# Altium project MCU023_MSP432E401Y.PrjPcb (part 3 of 3)

## Sheet MCU023_XDS110_Target_Interface.SchDoc
size 431 x 279 mm; Date: Not shown in title block; ApprovedBy: Not shown in title block; CheckedBy: Not shown in title block; Author: Not shown in title block; CompanyName: Not shown in title block; Engineer: Not shown in title block; Organization: Not shown in title block; Address1: Not shown in title block; Address2: Not shown in title block; Address3: Not shown in title block; Address4: Not shown in title block; DocumentNumber: 1; Revision: Use project parameter SCH_Rev; SheetNumber: 4; SheetTotal: 6; PageSetup: Record=PageOptions|CenterHorizontal=True|CenterVertical=True|PrintScale=1.00|XCorrection=1.00|YCorrection=1.00|PrintKind=0|BorderSize=5000000|LeftOffset=0|BottomOffset=0|Orientation=2|PaperLength=1000|PaperWidth=1000|Scale=100|PaperSource=15|PrintQuality=600|MediaType=1|DitherType=10|PaperKind=Letter|PrintScaleMode=1; CurrentTime: Not shown in title block; CurrentDate: Not shown in title block; Time: Not shown in title block; DocumentFullPathAndName: Not shown in title block; DocumentName: Not shown in title block; ModifiedDate: Not shown in title block; ImagePath: Not shown in title block
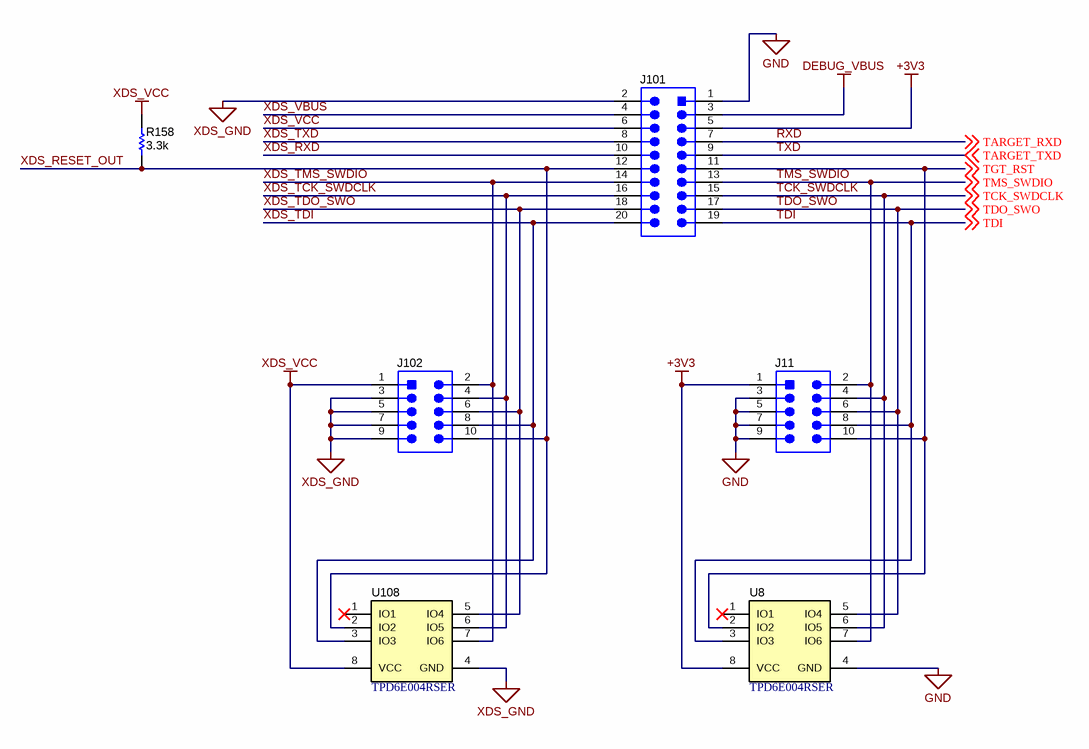
[diagram p3: MCU023_XDS110_Target_Interface.SchDoc]

### Parts
J11  FTSH-105-01-F-DV-K  [Samtec_FTSH-105-01-x-DV-K]  (value not drawn)
J101  PEC10DAAN  [SULLINS_PEC10DAAN]  (value not drawn)
J102  FTSH-105-01-F-DV-K  [Samtec_FTSH-105-01-x-DV-K]  (value not drawn)
R158  ValueDisplayed: 3.3k  [0402]  (hidden comment: CRCW04023K30JNED)
U8  TPD6E004RSER  [RSE0008A]
U108  TPD6E004RSER  [RSE0008A]

### Nets
+3V3: J11.1 J101.5 U8.8(VCC)
DEBUG_VBUS: J101.3
GND: J11.3 J11.5 J11.7 J11.9 J101.1 U8.4(GND)
XDS_GND: J101.2 J102.3 J102.5 J102.7 J102.9 U108.4(GND)
XDS_VCC: J101.6 J102.1 R158.2 U108.8(VCC)
RXD: J101.7 ; off-sheet TARGET_RXD  [also labelled TARGET_RXD]
TARGET_TXD: J101.9 ; off-sheet TARGET_TXD  [also labelled TXD]
TCK_SWDCLK: J11.4 J101.15 U8.6(IO5) ; off-sheet TCK_SWDCLK
TDI: J11.8 J101.19 U8.3(IO3) ; off-sheet TDI
TDO_SWO: J11.6 J101.17 U8.5(IO4) ; off-sheet TDO_SWO
TGT_RST: J11.10 J101.11 U8.2(IO2) ; off-sheet TGT_RST  [project net TARGET_RESET]
TMS_SWDIO: J11.2 J101.13 U8.7(IO6) ; off-sheet TMS_SWDIO
XDS_RESET_OUT: J101.12 J102.10 R158.1 U108.2(IO2)
XDS_RXD: J101.10
XDS_TCK_SWDCLK: J101.16 J102.4 U108.6(IO5)
XDS_TDI: J101.20 J102.8 U108.3(IO3)
XDS_TDO_SWO: J101.18 J102.6 U108.5(IO4)
XDS_TMS_SWDIO: J101.14 J102.2 U108.7(IO6)
XDS_TXD: J101.8
XDS_VBUS: J101.4

Not connected (* = marked no-connect by the designer): U8 1(IO1)*; U108 1(IO1)*

### Notes on the sheet
- Drawn By:
- SVN Rev:
- Number:
- TID #:
- Orderable:
- Rev:
- Sheet Title:
- File:
- Project Title:
- Designed for:
- Assembly Variant:
- Mod. Date:
- Sheet:
- Size:
- of
- B
- http://www.ti.com
- Texas Instruments and/or its licensors do not warrant the accuracy or completeness of this specification or any information contained therein. Texas Instruments and/or its licensors do not warrant that this design will meet the specifications, will be suitable for your application or fit for any particular purpose, or will operate in an implementation. Texas Instruments and/or its licensors do not warrant that the design is production worthy. You should completely validate and test your design implementation to confirm the system functionality for your application.
- Engineer:
- Contact:
- © Texas Instruments

### Library data of the parts
J11 J102 = FTSH-105-01-F-DV-K: Header (Shrouded), 1.27mm, 5x2, Gold, SMT; Manufacturer: Samtec; SymbolCreator: a0412235; Pitch_mm: 1.27; Gender: Male; Shrouded: Y; Row_Count: 2; Current_A: 3.3; SymbolVersion: 2013-12-22; PartNumber: FTSH-105-01-F-DV-K; PackageReference: Header(Shrouded), 1.27mm, 5x2, SMT; CompType: Header; RoHS: Y; MountType: SMT; ComponentLink1Description: Datasheet URL; ComponentLink1URL: http://suddendocs.samtec.com/prints/ftsh-1xx-xx-xxx-dv-xxx-mkt.pdf; Orientation: Vertical; PinCount: 10; RowSpacing_mm: 1.27; ContactFinish: Gold; Color: Black; Cert_CSA: Y; Cert_UL: Y; Publisher: Texas Instruments; LatestRevisionDate: 2016-12-09; Supplier 1: Digi-Key; Supplier Part Number 1: SAM8796-ND
J101 = PEC10DAAN: Header, 2.54mm, 10x2, Tin, TH; Manufacturer: Sullins Connector Solutions; SymbolCreator: a0412235; Pitch_mm: 2.54; Gender: Male; Shrouded: N; Row_Count: 2; Current_A: 3; Cert_UL: Y; Green_Lifecycle: Not Set; Green_REACh: Incomplete; SymbolVersion: 2013-09-12; PartNumber: PEC10DAAN; PackageReference: Header, 10x2, 2.54mm, TH; ClassName: Header; CompType: Header; RoHS: Y; MountType: TH; ComponentLink1Description: Datasheet URL; ComponentLink1URL: https://drawings-pdf.s3.amazonaws.com/C10419.pdf; Orientation: Vertical; PinCount: 20; RowSpacing_mm: 2.54; ContactFinish: Tin; Color: Black; Publisher: Texas Instruments; LatestRevisionDate: 2017-05-05; Supplier 1: Digi-Key; Supplier Part Number 1: S2012E-10-ND; Green_EU RoHS: Incomplete; Green_EU RoHS-2: Incomplete
R158 = CRCW04023K30JNED: RES, 3.3 k, 5%, 0.063 W, 0402; Manufacturer: Vishay-Dale; CompType: Resistor; Value: 3.3k; Res_ohm: 3300; Value_Code: 3k30; Tolerance_%: 5; Power_W: 0.063; Value2: 0.063W; VDC_V: 50; TempCo: 200 ppm/C; SizeArea_mm2: 0.5; SizeX_mm: 1; SizeZ_mm: 0.6; EIA_Code: E24; U/M: EA; AEC Category: Q200; SymbolVersion: 2009-05-29; PartNumber: CRCW04023K30JNED; PackageReference: 0402; RoHS: Y; Value1: 5%; MountType: SMT; Technology: Thick Film; SizeY_mm: 0.5; Published: 2008-06-26; Publisher: Texas Instruments; LatestRevisionDate: 2017-04-13; ComponentLink1Description: Datasheet link; ComponentLink1URL: http://www.vishay.com/docs/20035/dcrcwe3.pdf; Supplier 1: Digi-Key; Supplier Part Number 1: 541-3.3KJCT-ND; Supplier 2: Newark; Supplier Part Number 2: 59M6723; Supplier 3: Mouser; Supplier Part Number 3: 71-CRCW0402J-3.3K-E3; AEC Qualified: ?
U8 U108 = TPD6E004RSER: Low-Capacitance + / - 15 kV ESD Protection Array for High-Speed Data Interfaces, 6 Channels, -40 to +85 degC, 8-pin UQFN (RSE), Green (RoHS & no Sb/Br); Manufacturer: Texas Instruments; Alternate PartNumber: Equivalent; 1394 / Firewire: TRUE; Breakdown Voltage(Min)(V): 6; IEC 61000-4-2 Air-Gap(+/- kV): 12; IEC 61000-4-2 Contact(+/- kV): 8; IO Capacitance(Typ)(pF): 1.6; IO Leakage Current(nA): 1; SubFamily: ESD Solution; Note: TI Supplied; DatasheetVersion: SLLS799A; PackageVersion: revD, Jan-2011; PackageReference: RSE0008A; PackageDescription: 8-Pin Plastic Quad Flatpack No-Lead, 1.5 x 1.5 mm Body, 0.5 mm Pitch; Supplier 1: Digi-Key; Supplier Part Number 1: 296-23619-2-ND; Supplier 2: Digi-Key; Supplier Part Number 2: 296-23619-1-ND; Supplier 3: Digi-Key; Supplier Part Number 3: 296-23619-6-ND; Supplier 4: Farnell; Supplier Part Number 4: 1755333; Supplier 5: Newark; Supplier Part Number 5: 85M0178; Supplier 6: Mouser; Supplier Part Number 6: 595-TPD6E004RSER; Eco-Plan: Green (RoHS & no Sb/Br); Serial ATA / eSATA: TRUE; USB High Speed: TRUE; MountType: SMT; Code_JEDEC: MO-288; PartNumber: TPD6E004RSER; ComponentLink1Description: Datasheet; ComponentLink1URL: http://www.ti.com/general/docs/lit/getliterature.tsp?genericPartNumber=TPD6E004&fileType=pdf; ComponentLink2Description: URL Link1; ComponentLink2URL: SamplesURL:http://www.ti.com/product/tpd6e004#samples; Alternate Manufacturer: Texas Instruments

## Sheet MCU023_XDS110_Debug_Probe.SchDoc
size 431 x 279 mm; Date: Not shown in title block; ApprovedBy: Not shown in title block; CheckedBy: Not shown in title block; Author: Not shown in title block; CompanyName: Not shown in title block; Engineer: Not shown in title block; Organization: Not shown in title block; Address1: Not shown in title block; Address2: Not shown in title block; Address3: Not shown in title block; Address4: Not shown in title block; DocumentNumber: 1; Revision: Use project parameter SCH_Rev; SheetNumber: 5; SheetTotal: 6; PageSetup: Record=PageOptions|CenterHorizontal=True|CenterVertical=True|PrintScale=1.00|XCorrection=1.00|YCorrection=1.00|PrintKind=0|BorderSize=5000000|LeftOffset=0|BottomOffset=0|Orientation=2|PaperLength=1000|PaperWidth=1000|Scale=100|PaperSource=15|PrintQuality=600|MediaType=1|DitherType=10|PaperKind=Letter|PrintScaleMode=1; CurrentTime: Not shown in title block; CurrentDate: Not shown in title block; Time: Not shown in title block; DocumentFullPathAndName: Not shown in title block; DocumentName: Not shown in title block; ModifiedDate: Not shown in title block; ImagePath: Not shown in title block
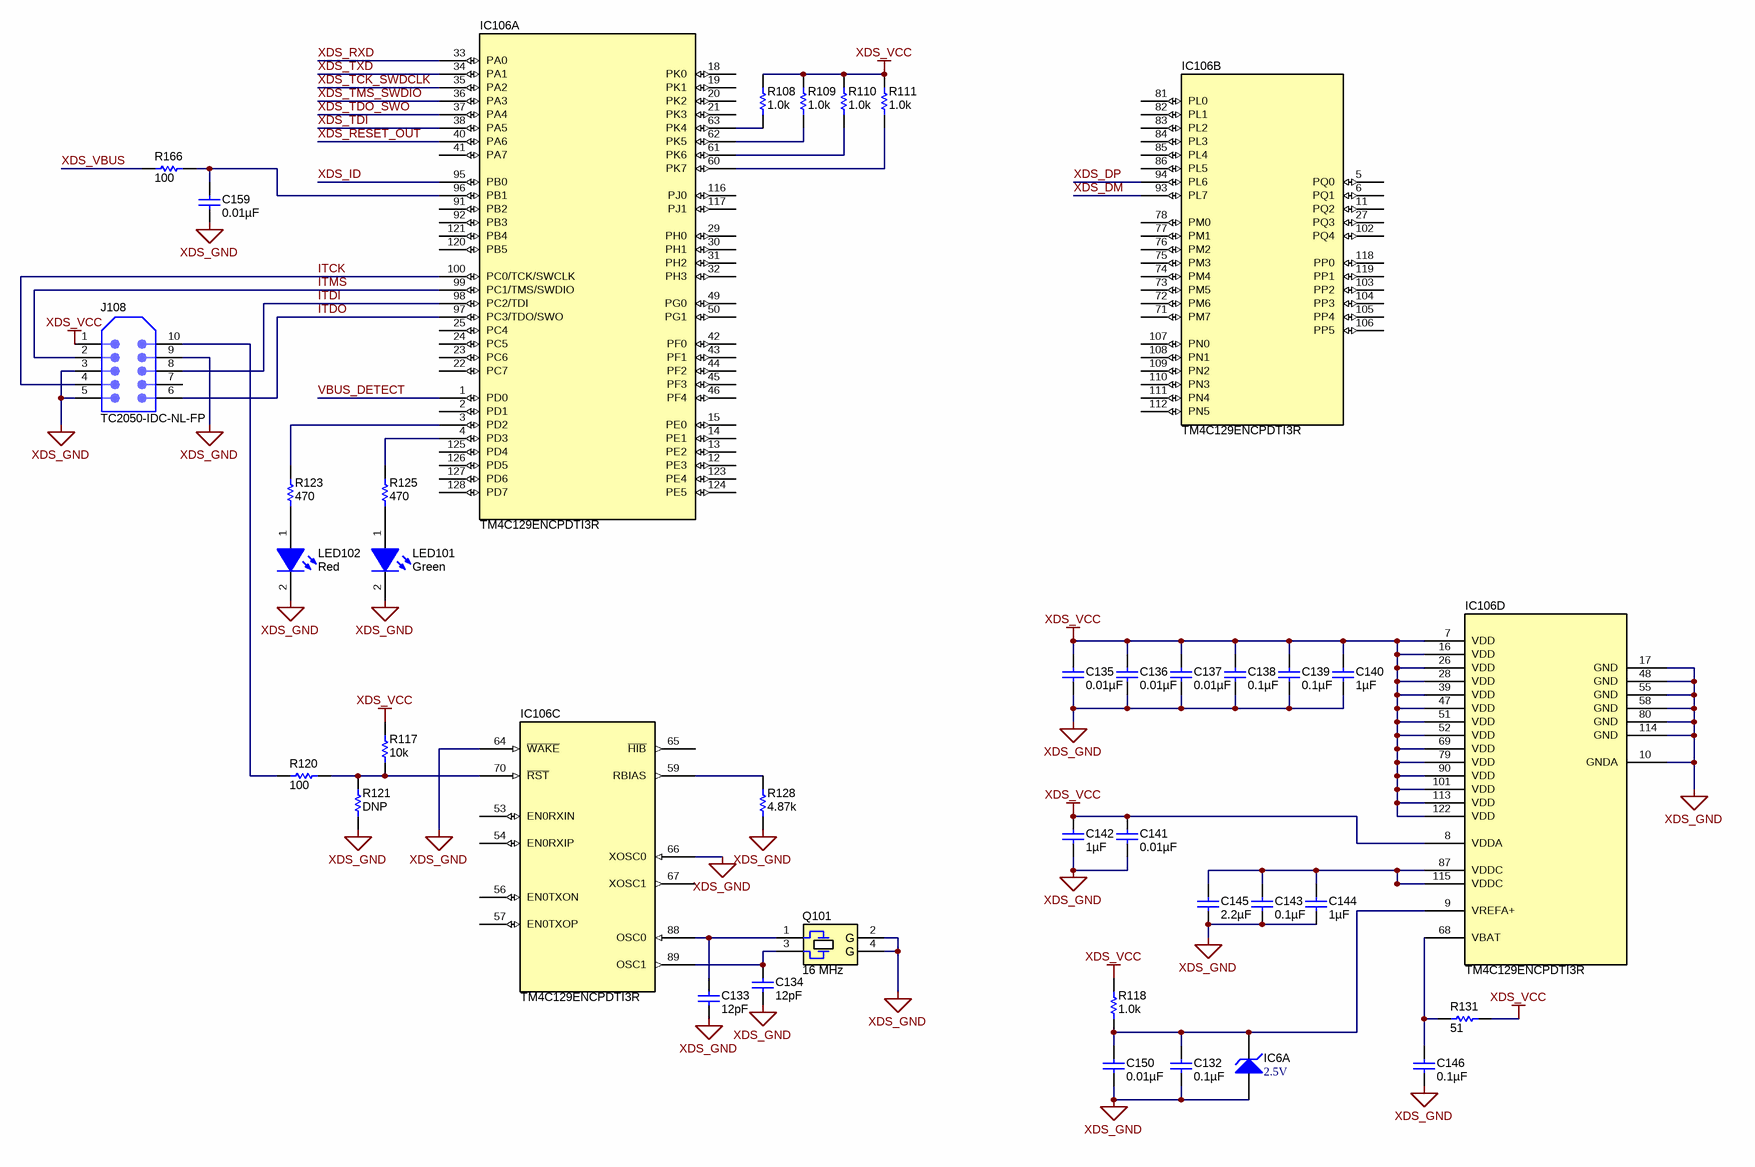
[diagram p4: MCU023_XDS110_Debug_Probe.SchDoc]

### Parts
C132  ValueDisplayed: 0.1µF  [0402]  (hidden comment: GRM155R70J104KA01D)
C133  ValueDisplayed: 12pF  [0402]  (hidden comment: GRM1555C1H120JA01D)
C134  ValueDisplayed: 12pF  [0402]  (hidden comment: GRM1555C1H120JA01D)
C135  ValueDisplayed: 0.01µF  [0402]  (hidden comment: GRM155R71E103KA01D)
C136  ValueDisplayed: 0.01µF  [0402]  (hidden comment: GRM155R71E103KA01D)
C137  ValueDisplayed: 0.01µF  [0402]  (hidden comment: GRM155R71E103KA01D)
C138  ValueDisplayed: 0.1µF  [0402]  (hidden comment: GRM155R70J104KA01D)
C139  ValueDisplayed: 0.1µF  [0402]  (hidden comment: GRM155R70J104KA01D)
C140  ValueDisplayed: 1µF  [0402]  (hidden comment: GRM155R61A105KE15D)
C141  ValueDisplayed: 0.01µF  [0402]  (hidden comment: GRM155R71E103KA01D)
C142  ValueDisplayed: 1µF  [0402]  (hidden comment: GRM155R61A105KE15D)
C143  ValueDisplayed: 0.1µF  [0402]  (hidden comment: GRM155R70J104KA01D)
C144  ValueDisplayed: 1µF  [0402]  (hidden comment: GRM155R61A105KE15D)
C145  ValueDisplayed: 2.2µF  [0402]  (hidden comment: GRM155R60J225KE95D)
C146  ValueDisplayed: 0.1µF  [0402]  (hidden comment: GRM155R70J104KA01D)
C150  ValueDisplayed: 0.01µF  [0402]  (hidden comment: GRM155R71E103KA01D)
C159  ValueDisplayed: 0.01µF  [0402]  (hidden comment: GRM155R71E103KA01D)
IC6  2.5V  [DCK0005A_N]  (part A of 2)
IC106  TM4C129ENCPDTI3R  [PDT0128A]  (parts A,B,C,D of 4)
J108  TC2050-IDC-NL-FP  [Tag_TC2050-NL]  (no BOM)
LED101  value Green  [LED_LTST-C190]  (hidden comment: LTST-C190GKT)
LED102  value Red  [LED_LTST-C190_Red]  (hidden comment: LTST-C190CKT)
Q101  Frequency: 16 MHz  [NDK_NX3225GA]  (hidden comment: NX3225GA-16.000M-STD-CRG-1)
R108  ValueDisplayed: 1.0k  [0402]  (hidden comment: CRCW04021K00JNED)
R109  ValueDisplayed: 1.0k  [0402]  (hidden comment: CRCW04021K00JNED)
R110  ValueDisplayed: 1.0k  [0402]  (hidden comment: CRCW04021K00JNED)
R111  ValueDisplayed: 1.0k  [0402]  (hidden comment: CRCW04021K00JNED)
R117  ValueDisplayed: 10k  [0402]  (hidden comment: CRCW040210K0JNED)
R118  ValueDisplayed: 1.0k  [0402]  (hidden comment: CRCW04021K00JNED)
R120  ValueDisplayed: 100  [0402]  (hidden comment: CRCW0402100RJNED)
R121  ValueDisplayed: DNP  [0402]  (hidden comment: CRCW040210K0JNED)
R123  ValueDisplayed: 470  [0402]  (hidden comment: ERJ-2RKF4700X)
R125  ValueDisplayed: 470  [0402]  (hidden comment: ERJ-2RKF4700X)
R128  ValueDisplayed: 4.87k  [0402]  (hidden comment: CRCW04024K87FKED)
R131  ValueDisplayed: 51  [0402]  (hidden comment: CRCW040251R0JNED)
R166  ValueDisplayed: 100  [0402]  (hidden comment: CRCW0402100RJNED)

### Nets
XDS_GND: C132.2 C133.2 C134.2 C135.2 C136.2 C137.2 C138.2 C139.2 C140.2 C141.2 C142.2 C143.2 C144.2 C145.2 C146.2 C150.2 C159.2 IC6.1(ANODE) IC106.10(GNDA) IC106.17(GND) IC106.48(GND) IC106.55(GND) IC106.58(GND) IC106.64(~{WAKE}) IC106.66(XOSC0) IC106.80(GND) IC106.114(GND) J108.3 J108.5 J108.9 LED101.2(K) LED102.2(K) Q101.2(GND) Q101.4(GND) R121.1 R128.1
XDS_VCC: C135.1 C136.1 C137.1 C138.1 C139.1 C140.1 C141.1 C142.1 IC106.7(VDD) IC106.8(VDDA) IC106.16(VDD) IC106.26(VDD) IC106.28(VDD) IC106.39(VDD) IC106.47(VDD) IC106.51(VDD) IC106.52(VDD) IC106.69(VDD) IC106.79(VDD) IC106.90(VDD) IC106.101(VDD) IC106.113(VDD) IC106.122(VDD) J108.1 R108.2 R109.2 R110.2 R111.2 R117.2 R118.2 R131.2
ITCK: IC106.100(PC0/TCK/SWCLK) J108.4
ITDI: IC106.98(PC2/TDI) J108.8
ITDO: IC106.97(PC3/TDO/SWO) J108.6
ITMS: IC106.99(PC1/TMS/SWDIO) J108.2
VBUS_DETECT: IC106.1(PD0)
XDS_DM: IC106.93(PL7)
XDS_DP: IC106.94(PL6)
XDS_ID: IC106.95(PB0)
XDS_RESET_OUT: IC106.40(PA6)
XDS_RXD: IC106.33(PA0)
XDS_TCK_SWDCLK: IC106.35(PA2)
XDS_TDI: IC106.38(PA5)
XDS_TDO_SWO: IC106.37(PA4)
XDS_TMS_SWDIO: IC106.36(PA3)
XDS_TXD: IC106.34(PA1)
XDS_VBUS: R166.1
NetC132_1: C132.1 C150.1 IC6.3(CATHODE) IC106.9(VREFA+) R118.1
NetC133_1: C133.1 IC106.88(OSC0) Q101.1
NetC134_1: C134.1 IC106.89(OSC1) Q101.3
NetC143_1: C143.1 C144.1 C145.1 IC106.87(VDDC) IC106.115(VDDC)
NetC146_1: C146.1 IC106.68(VBAT) R131.1
NetC159_1: C159.1 IC106.96(PB1) R166.2
NetIC106_3: IC106.3(PD2) R123.2
NetIC106_4: IC106.4(PD3) R125.2
NetIC106_59: IC106.59(RBIAS) R128.2
NetIC106_60: IC106.60(PK7) R111.1
NetIC106_61: IC106.61(PK6) R110.1
NetIC106_62: IC106.62(PK5) R109.1
NetIC106_63: IC106.63(PK4) R108.1
NetIC106_70: IC106.70(~{RST}) R117.1 R120.2 R121.2
NetJ108_10: J108.10 R120.1
NetLED101_1: LED101.1(A) R125.1
NetLED102_1: LED102.1(A) R123.1

Not connected (* = marked no-connect by the designer): IC106 2(PD1) 5(PQ0) 6(PQ1) 11(PQ2) 12(PE3) 13(PE2) 14(PE1) 15(PE0) 18(PK0) 19(PK1) 20(PK2) 21(PK3) 22(PC7) 23(PC6) 24(PC5) 25(PC4) 27(PQ3) 29(PH0) 30(PH1) 31(PH2) 32(PH3) 41(PA7) 42(PF0) 43(PF1) 44(PF2) 45(PF3) 46(PF4) 49(PG0) 50(PG1) 53(EN0RXIN) 54(EN0RXIP) 56(EN0TXON) 57(EN0TXOP) 65(~{HIB}) 67(XOSC1) 71(PM7) 72(PM6) 73(PM5) 74(PM4) 75(PM3) 76(PM2) 77(PM1) 78(PM0) 81(PL0) 82(PL1) 83(PL2) 84(PL3) 85(PL4) 86(PL5) 91(PB2) 92(PB3) 102(PQ4) 103(PP2) 104(PP3) 105(PP4) 106(PP5) 107(PN0) 108(PN1) 109(PN2) 110(PN3) 111(PN4) 112(PN5) 116(PJ0) 117(PJ1) 118(PP0) 119(PP1) 120(PB5) 121(PB4) 123(PE4) 124(PE5) 125(PD4) 126(PD5) 127(PD6) 128(PD7); J108 7

### Notes on the sheet
- Drawn By:
- SVN Rev:
- Number:
- TID #:
- Orderable:
- Rev:
- Sheet Title:
- File:
- Project Title:
- Designed for:
- Assembly Variant:
- Mod. Date:
- Sheet:
- Size:
- of
- B
- http://www.ti.com
- Texas Instruments and/or its licensors do not warrant the accuracy or completeness of this specification or any information contained therein. Texas Instruments and/or its licensors do not warrant that this design will meet the specifications, will be suitable for your application or fit for any particular purpose, or will operate in an implementation. Texas Instruments and/or its licensors do not warrant that the design is production worthy. You should completely validate and test your design implementation to confirm the system functionality for your application.
- Engineer:
- Contact:
- © Texas Instruments
- (in symbol NX3225GA-16.000M-STD-CRG-1) G

### Library data of the parts
C132 C138 C139 C143 C146 = GRM155R70J104KA01D: CAP, CERM, 0.1 µF, 6.3 V, +/- 10%, X7R, 0402; Manufacturer: MuRata; Polarized: N; CompType: Capacitor; Value: 0.1uF; U/M: EA; Cap_F: 0.0000001; Tolerance_%: 10; Value1: Unknown; VDC_V: 6.3; Value2: 6.3V; TaMin_C: -55; TaMax_C: 125; SizeArea_mm2: 0.5; SizeAreaWB_mm2: 3; SizeX_mm: 1; SizeZ_mm: 0.6; AEC Category: Q200; SymbolVersion: 2008-07-09; PartNumber: GRM155R70J104KA01D; PackageReference: 0402; RoHS: Y; MountType: SMT; Technology: Ceramic; TempCo: X7R; Cap_Case: 0402; SizeY_mm: 0.5; Published: 2008-06-19; Publisher: Texas Instruments; LatestRevisionDate: 2017-04-21; ComponentLink1Description: Datasheet link; ComponentLink1URL: http://search.murata.co.jp/Ceramy/PnsearchViewAction.do?HnOFG=ON&HnNFG=ON&SEL_CNT=50&sLang=en&sKey=GRM155R70J104KA01D&x=9&y=9&search=startwith; Supplier 1: Digi-Key; Supplier Part Number 1: GRM155R70J104KA01D-ND; Supplier 2: Mouser; Supplier Part Number 2: 81-GRM155R70J104KA1D; AEC Qualified: ?
C133 C134 = GRM1555C1H120JA01D: CAP, CERM, 12 pF, 50 V, +/- 5%, C0G/NP0, 0402; Manufacturer: MuRata; Polarized: N; CompType: Capacitor; Value: 12pF; U/M: EA; Cap_F: 0.000000000012; Tolerance_%: 5; Value1: Unknown; VDC_V: 50; Value2: 50V; TaMin_C: -55; TaMax_C: 125; SizeArea_mm2: 0.5; SizeAreaWB_mm2: 3; SizeX_mm: 1; SizeZ_mm: 0.6; AEC Category: Q200; SymbolVersion: 2008-07-09; PartNumber: GRM1555C1H120JA01D; PackageReference: 0402; RoHS: Y; MountType: SMT; Technology: Ceramic; TempCo: C0G/NP0; Cap_Case: 0402; SizeY_mm: 0.5; Published: 2008-06-19; Publisher: Texas Instruments; LatestRevisionDate: 2017-04-21; ComponentLink1Description: Datasheet link; ComponentLink1URL: http://search.murata.co.jp/Ceramy/PnsearchViewAction.do?HnOFG=ON&HnNFG=ON&SEL_CNT=50&sLang=en&sKey=GRM1555C1H120JA01D&x=9&y=9&search=startwith; Supplier 1: Newark; Supplier Part Number 1: 14T3292; Supplier 2: Mouser; Supplier Part Number 2: 81-GRM1555C1H120JA1D; Supplier 3: Farnell; Supplier Part Number 3: 1828875; AEC Qualified: ?
C135-C137 C141 C150 C159 = GRM155R71E103KA01D: CAP, CERM, 0.01 µF, 25 V, +/- 10%, X7R, 0402; Manufacturer: MuRata; Polarized: N; CompType: Capacitor; Value: 0.01uF; U/M: EA; Cap_F: 0.00000001; Tolerance_%: 10; Value1: Unknown; VDC_V: 25; Value2: 25V; TaMin_C: -55; TaMax_C: 125; SizeArea_mm2: 0.5; SizeAreaWB_mm2: 3; SizeX_mm: 1; SizeZ_mm: 0.6; AEC Category: Q200; SymbolVersion: 2008-07-09; PartNumber: GRM155R71E103KA01D; PackageReference: 0402; RoHS: Y; MountType: SMT; Technology: Ceramic; TempCo: X7R; Cap_Case: 0402; SizeY_mm: 0.5; Published: 2008-06-19; Publisher: Texas Instruments; LatestRevisionDate: 2017-04-21; ComponentLink1Description: Datasheet link; ComponentLink1URL: http://search.murata.co.jp/Ceramy/PnsearchViewAction.do?HnOFG=ON&HnNFG=ON&SEL_CNT=50&sLang=en&sKey=GRM155R71E103KA01D&x=9&y=9&search=startwith; Supplier 1: Digi-Key; Supplier Part Number 1: 490-1312-1-ND; Supplier 2: Mouser; Supplier Part Number 2: 81-GRM36X103K25; Supplier 3: Farnell; Supplier Part Number 3: 8819734; AEC Qualified: ?
C140 C142 C144 = GRM155R61A105KE15D: CAP, CERM, 1 µF, 10 V, +/- 10%, X5R, 0402; Manufacturer: MuRata; Polarized: N; CompType: Capacitor; Value: 1uF; U/M: EA; Cap_F: 0.000001; Tolerance_%: 10; Value1: Unknown; Value2: 10V; TaMin_C: -55; TaMax_C: 85; SizeArea_mm2: 0.5; SizeAreaWB_mm2: 3; SizeX_mm: 1; SizeZ_mm: 0.6; AEC Category: Q200; SymbolVersion: 2008-07-09; PartNumber: GRM155R61A105KE15D; PackageReference: 0402; RoHS: Y; VDC_V: 10; MountType: SMT; Technology: Ceramic; TempCo: X5R; Cap_Case: 0402; SizeY_mm: 0.5; Published: 2008-06-19; Publisher: Texas Instruments; LatestRevisionDate: 2017-04-21; ComponentLink1Description: Datasheet link; ComponentLink1URL: http://search.murata.co.jp/Ceramy/PnsearchViewAction.do?HnOFG=ON&HnNFG=ON&SEL_CNT=50&sLang=en&sKey=GRM155R61A105KE15D&x=9&y=9&search=startwith; Supplier 1: Digi-Key; Supplier Part Number 1: 490-3890-1-ND; Supplier 2: Mouser; Supplier Part Number 2: 81-GRM155R61A105KE15; Supplier 3: Farnell; Supplier Part Number 3: 1735523; AEC Qualified: ?
C145 = GRM155R60J225KE95D: CAP, CERM, 2.2 µF, 6.3 V, +/- 10%, X5R, 0402; Manufacturer: MuRata; Polarized: N; CompType: Capacitor; Value: 2.2uF; U/M: EA; Cap_F: 0.0000022; Tolerance_%: 10; Value1: Unknown; VDC_V: 6.3; Value2: 6.3V; TaMin_C: -55; TaMax_C: 85; SizeArea_mm2: 0.5; SizeAreaWB_mm2: 3; SizeX_mm: 1; SizeZ_mm: 0.6; AEC Category: Q200; SymbolVersion: 2008-07-09; PartNumber: GRM155R60J225KE95D; PackageReference: 0402; RoHS: Y; MountType: SMT; Technology: Ceramic; TempCo: X5R; Cap_Case: 0402; SizeY_mm: 0.5; Published: 2008-06-19; Publisher: Texas Instruments; LatestRevisionDate: 2017-04-21; ComponentLink1Description: Datasheet link; ComponentLink1URL: http://psearch.en.murata.com/capacitor/product/GRM155R60J225KE95%23.pdf; Supplier 1: Mouser; Supplier Part Number 1: 81-GRM155R60J225KE5D; AEC Qualified: N; AEC Grade: N/A
IC6 = LM4040B25IDCKR: Precision Micropower Shunt Voltage Reference, 0.2% accuracy, 2.5 V, 15 ppm / degC, 15 mA, -40 to 85 degC, 5-pin SC70 (DCK), Green (RoHS & no Sb/Br); Manufacturer: Texas Instruments; Alternate PartNumber: Equivalent; PartNumber: LM4040B25IDCKRA; Initial Accuracy @ 25/deg C(%): 0.2; Iout/Iz(Max)(mA): 15; Min Iz for Regulation(uA): 75; Rating: Catalog; Temp Coeff(Max)(ppm/ degree C): 100; VO(V): 2.5; Note: TI Supplied; DatasheetVersion: SLOS456K; PackageReference: DCK0005A; PackageDescription: 5-Pin Plastic Small-Outline Package, 2 x 1.3 mm Body, 0.65 mm Pitch, 2.1 mm Lead Span; Supplier 1: Digi-Key; Supplier Part Number 1: 296-20873-2-ND; Supplier 2: Digi-Key; Supplier Part Number 2: 296-20873-1-ND; Supplier 3: Digi-Key; Supplier Part Number 3: 296-20873-6-ND; Supplier 4: Newark; Supplier Part Number 4: 53K9331; Supplier 5: Mouser; Supplier Part Number 5: 595-LM4040B25IDCKR; Eco-Plan: Green (RoHS & no Sb/Br); SubFamily: Shunt Voltage Reference; Temp Coeff(Typ)(ppm/ degree C): 15; MountType: SMT; Code_JEDEC: MO-203; ComponentLink1Description: Manufacturer URL; ComponentLink1URL: http://www.ti.com/; ComponentLink2Description: Datasheet; ComponentLink2URL: http://www.ti.com/general/docs/lit/getliterature.tsp?genericPartNumber=LM4040B25&fileType=pdf; ComponentLink3Description: Package Specification; ComponentLink3URL: http://www.ti.com/litv/pdf/mpds025f; Alternate Manufacturer: Texas Instruments
IC106 = TM4C129ENCPDTI3R: IoT enabled High performance 32-bit ARM(R) Cortex(R)-M4F based MCU, PDT0128A (TQFP-128); Manufacturer: Texas Instruments; SymbolCreator: a0411947; SizeArea_mm2: 256; SizeAreaWB_mm2: 324; SizeX_mm: 16; SizeZ_mm: 1.2; CompType: IC; U/M: EA; Note: TI Supplied; SymbolVersion: 2015-10-15; PartNumber: TM4C129ENCPDTI3R; Alternate PartNumber: TM4C129ENCPDTI3; PackageReference: PDT0128A; PackageDescription: TQFP-128; MountType: SMT; SizeY_mm: 16; ComponentLink1Description: Datasheet Link; ComponentLink1URL: http://www.ti.com/lit/ds/symlink/tm4c129encpdt.pdf; RoHS: Y; Publisher: Texas Instruments; LatestRevisionDate: 2017-03-30; Alternate Manufacturer: Texas Instruments
J108 = TC2050-IDC-NL-FP: Footprint for Tag-Connect TC2050 No-Legs cables; SymbolCreator: Altium; CompType: Receptacle; Note: Footprint only, to mate with Tag-Connect TC2050 No-Legs cables; SymbolVersion: 2015-06-15; PartNumber: TC2050-IDC-NL-FP; Manufacturer: Tag-Connect; PackageReference: Footprint for TC2050 No Legs series of cables; MountType: N/A; ComponentLink1Description: Datasheet URL; ComponentLink1URL: http://www.tag-connect.com/Materials/TC2050-IDC-430-NL%20Datasheet.pdf; Publisher: Texas Instruments; LatestRevisionDate: 2017-04-03
LED101 = LTST-C190GKT: LED, Green, SMD; Manufacturer: Lite-On; Vf_V: 2.1; Value2: 2.1V; Io_A: 0.02; Power_TotalModule: 0.1; Value1: 0.1W; U/M: EA; SymbolVersion: 2017-01-11; PartNumber: LTST-C190GKT; PackageReference: 1.6x0.8x0.8mm; RoHS: Y; CompType: LED; Type: ?; MountType: SMT; Color: green; Published: 2008-07-11; Publisher: Texas Instruments; ComponentLink1URL: https://sps06.itg.ti.com/sites/KMS/crossdivteams/altium/docs/ComponentDatasheets/LTST-C190GKT.pdf; ComponentLink1Description: Datasheet link; LatestRevisionDate: 2017-04-18; Supplier 1: Digi-Key; Supplier Part Number 1: 160-1183-1-ND; Supplier 2: Mouser; Supplier Part Number 2: 859-LTST-C190GKT
LED102 = LTST-C190CKT: LED, Red, SMD; Manufacturer: Lite-On; Vf_V: 2; Value2: 2V; Io_A: 0.02; Tjmax_C: 85; Power_TotalModule: 0.0625; Value1: 0.0625W; U/M: EA; SymbolVersion: 2017-01-11; PartNumber: LTST-C190CKT; PackageReference: Red LED, 1.6x0.8x0.8mm; RoHS: Y; CompType: LED; Type: ?; MountType: SMT; Color: red; Published: 2008-07-11; Publisher: Texas Instruments; ComponentLink1URL: http://optoelectronics.liteon.com/en-us/api/DwonloadFileHandler.ashx?txtSpecNo=DS-22-98-0009&txtPartNo=LTST-C190CKT; ComponentLink1Description: Datasheet link; LatestRevisionDate: 2017-04-18; Supplier 1: Digi-Key; Supplier Part Number 1: 160-1181-1-ND; Supplier 2: Mouser; Supplier Part Number 2: 859-LTST-C190CKT
Q101 = NX3225GA-16.000M-STD-CRG-1: Crystal, 16MHz, 8pF, SMD; Manufacturer: NDK; SymbolCreator: a0412235; U/M: EA; TaMin_C: -10; TaMax_C: 70; Frequency Stability: ±30ppm; SymbolVersion: 2016-1-26; PartNumber: NX3225GA-16.000M-STD-CRG-1; CompType: Crystal; PackageReference: 3.2x0.75x2.5mm; MountType: SMT; RoHS: Y; ComponentLink1Description: Datasheet Link; ComponentLink1URL: http://www.ndk.com/images/products/catalog/c_NX3225GA-STD-CRG-1_e.pdf; Publisher: Texas Instruments; LatestRevisionDate: 2017-03-31; Supplier 1: Digi-Key; Supplier Part Number 1: 644-1157-1-ND
R108-R111 R118 = CRCW04021K00JNED: RES, 1.0 k, 5%, 0.063 W, 0402; Manufacturer: Vishay-Dale; CompType: Resistor; Value: 1.0k; Res_ohm: 1000; Value_Code: 1k00; Tolerance_%: 5; Power_W: 0.063; Value2: 0.063W; VDC_V: 50; TempCo: 200 ppm/C; SizeArea_mm2: 0.5; SizeX_mm: 1; SizeZ_mm: 0.6; EIA_Code: E24; U/M: EA; AEC Category: Q200; SymbolVersion: 2009-05-29; PartNumber: CRCW04021K00JNED; PackageReference: 0402; RoHS: Y; Value1: 5%; MountType: SMT; Technology: Thick Film; SizeY_mm: 0.5; Published: 2008-06-26; Publisher: Texas Instruments; LatestRevisionDate: 2017-04-13; ComponentLink1Description: Datasheet link; ComponentLink1URL: http://www.vishay.com/docs/20035/dcrcwe3.pdf; Supplier 1: Digi-Key; Supplier Part Number 1: 541-1.0KJCT-ND; Supplier 2: Newark; Supplier Part Number 2: 59M6691; Supplier 3: Mouser; Supplier Part Number 3: 71-CRCW0402J-1.0K-E3; AEC Qualified: ?
R117 = CRCW040210K0JNED: RES, 10 k, 5%, 0.063 W, 0402; Manufacturer: Vishay-Dale; CompType: Resistor; Value: 10k; Res_ohm: 10000; Value_Code: 10k0; Tolerance_%: 5; Power_W: 0.063; Value2: 0.063W; VDC_V: 50; TempCo: 200 ppm/C; SizeArea_mm2: 0.5; SizeX_mm: 1; SizeZ_mm: 0.6; EIA_Code: E24; U/M: EA; AEC Category: Q200; SymbolVersion: 2009-05-29; PartNumber: CRCW040210K0JNED; PackageReference: 0402; RoHS: Y; Value1: 5%; MountType: SMT; Technology: Thick Film; SizeY_mm: 0.5; Published: 2008-06-26; Publisher: Texas Instruments; LatestRevisionDate: 2017-04-13; ComponentLink1Description: Datasheet link; ComponentLink1URL: http://www.vishay.com/docs/20035/dcrcwe3.pdf; Supplier 1: Digi-Key; Supplier Part Number 1: 541-10KJCT-ND; Supplier 2: Newark; Supplier Part Number 2: 59M6696; Supplier 3: Mouser; Supplier Part Number 3: 71-CRCW0402J-10K-E3; AEC Qualified: ?
R120 R166 = CRCW0402100RJNED: RES, 100, 5%, 0.063 W, 0402; Manufacturer: Vishay-Dale; CompType: Resistor; Value: 100; Value_Code: 100R; Tolerance_%: 5; Power_W: 0.063; Value2: 0.063W; VDC_V: 50; TempCo: 200 ppm/C; SizeArea_mm2: 0.5; SizeX_mm: 1; SizeZ_mm: 0.6; EIA_Code: E24; U/M: EA; AEC Category: Q200; SymbolVersion: 2009-05-29; PartNumber: CRCW0402100RJNED; PackageReference: 0402; RoHS: Y; Res_ohm: 100; Value1: 5%; MountType: SMT; Technology: Thick Film; SizeY_mm: 0.5; Published: 2008-06-26; Publisher: Texas Instruments; LatestRevisionDate: 2017-04-13; ComponentLink1Description: Datasheet link; ComponentLink1URL: http://www.vishay.com/docs/20035/dcrcwe3.pdf; Supplier 1: Digi-Key; Supplier Part Number 1: 541-100JCT-ND; Supplier 2: Newark; Supplier Part Number 2: 59M6700; Supplier 3: Mouser; Supplier Part Number 3: 71-CRCW0402J-100-E3; AEC Qualified: ?
R121 = CRCW040210K0JNED: RES, 10 k, 5%, 0.063 W, 0402; Manufacturer: Vishay-Dale; CompType: Resistor; Value: 10K; Res_ohm: 10000; Value_Code: 10k0; Tolerance_%: 5; Power_W: 0.063; Value2: 0.063W; VDC_V: 50; TempCo: 200 ppm/C; SizeArea_mm2: 0.5; SizeX_mm: 1; SizeZ_mm: 0.6; EIA_Code: E24; U/M: EA; AEC Category: Q200; SymbolVersion: 2009-05-29; PartNumber: CRCW040210K0JNED; PackageReference: 0402; RoHS: Y; Value1: 5%; MountType: SMT; Technology: Thick Film; SizeY_mm: 0.5; Published: 2008-06-26; Publisher: Texas Instruments; LatestRevisionDate: 2017-04-13; ComponentLink1Description: Datasheet link; ComponentLink1URL: http://www.vishay.com/docs/20035/dcrcwe3.pdf; Supplier 1: Digi-Key; Supplier Part Number 1: 541-10KJCT-ND; Supplier 2: Newark; Supplier Part Number 2: 59M6696; Supplier 3: Mouser; Supplier Part Number 3: 71-CRCW0402J-10K-E3; AEC Qualified: ?; Note: DNP
R123 R125 = ERJ-2RKF4700X: RES, 470, 1%, 0.1 W, AEC-Q200 Grade 0, 0402; Manufacturer: Panasonic; CompType: Resistor; Value: 470; Value_Code: 470R; Tolerance_%: 1; Power_W: 0.1; Value2: 0.1W; VDC_V: 50; TempCo: 100 ppm/C; SizeArea_mm2: 0.5; SizeZ_mm: 0.6; U/M: EA; AEC Category: Q200; AEC Qualified: Y; AEC Grade: 0; SymbolVersion: 2009-05-29; PartNumber: ERJ-2RKF4700X; PackageReference: 0402; RoHS: Y; Res_ohm: 470; Value1: 1%; MountType: SMT; Technology: Thick Film; SizeX_mm: 1; SizeY_mm: 0.5; Published: 2008-06-26; Publisher: Texas Instruments; LatestRevisionDate: 2017-04-13; ComponentLink1Description: Datasheet link; ComponentLink1URL: http://industrial.panasonic.com/lecs/www-data/pdf/AOA0000/AOA0000CE2.pdf; Supplier 1: Digi-Key; Supplier Part Number 1: P470LCT-ND; Supplier 2: Mouser; Supplier Part Number 2: 667-ERJ-2RKF4700X; Supplier 3: Farnell; Supplier Part Number 3: 2397145
R128 = CRCW04024K87FKED: RES, 4.87 k, 1%, 0.063 W, 0402; Manufacturer: Vishay-Dale; CompType: Resistor; Value: 4.87k; Res_ohm: 4870; Value_Code: 4k87; Tolerance_%: 1; Power_W: 0.063; Value2: 0.063W; VDC_V: 50; TempCo: 100 ppm/C; SizeArea_mm2: 0.5; SizeZ_mm: 0.6; EIA_Code: E96; U/M: EA; AEC Category: Q200; SymbolVersion: 2009-05-29; PartNumber: CRCW04024K87FKED; PackageReference: 0402; RoHS: Y; Value1: 1%; MountType: SMT; Technology: Thick Film; SizeX_mm: 1; SizeY_mm: 0.5; Published: 2008-06-26; Publisher: Texas Instruments; LatestRevisionDate: 2017-04-13; ComponentLink1Description: Datasheet link; ComponentLink1URL: http://www.vishay.com/docs/20035/dcrcwe3.pdf; Supplier 1: Digi-Key; Supplier Part Number 1: 541-4.87KLCT-ND; Supplier 2: Newark; Supplier Part Number 2: 52K7047; Supplier 3: Mouser; Supplier Part Number 3: 71-CRCW0402-4.87K-E3; AEC Qualified: ?
R131 = CRCW040251R0JNED: RES, 51, 5%, 0.063 W, 0402; Manufacturer: Vishay-Dale; CompType: Resistor; Value: 51; Value_Code: 51R0; Tolerance_%: 5; Power_W: 0.063; Value2: 0.063W; VDC_V: 50; TempCo: 200 ppm/C; SizeArea_mm2: 0.5; SizeX_mm: 1; SizeZ_mm: 0.6; EIA_Code: E24; U/M: EA; AEC Category: Q200; SymbolVersion: 2009-05-29; PartNumber: CRCW040251R0JNED; PackageReference: 0402; RoHS: Y; Res_ohm: 51; Value1: 5%; MountType: SMT; Technology: Thick Film; SizeY_mm: 0.5; Published: 2008-06-26; Publisher: Texas Instruments; LatestRevisionDate: 2017-04-13; ComponentLink1Description: Datasheet link; ComponentLink1URL: http://www.vishay.com/docs/20035/dcrcwe3.pdf; Supplier 1: Digi-Key; Supplier Part Number 1: 541-51JCT-ND; Supplier 2: Newark; Supplier Part Number 2: 72M6804; Supplier 3: Mouser; Supplier Part Number 3: 71-CRCW0402J-51-E3; AEC Qualified: ?

## Sheet MCU023_Hardware.SchDoc
size 431 x 279 mm; Date: Not shown in title block; ApprovedBy: Not shown in title block; CheckedBy: Not shown in title block; Author: Not shown in title block; CompanyName: Not shown in title block; Engineer: Not shown in title block; Organization: Not shown in title block; Address1: Not shown in title block; Address2: Not shown in title block; Address3: Not shown in title block; Address4: Not shown in title block; DocumentNumber: 1; Revision: Use project parameter SCH_Rev; SheetNumber: 6; SheetTotal: 6; PageSetup: Record=PageOptions|CenterHorizontal=True|CenterVertical=True|PrintScale=1.00|XCorrection=1.00|YCorrection=1.00|PrintKind=0|BorderSize=5000000|LeftOffset=0|BottomOffset=0|Orientation=2|PaperLength=1000|PaperWidth=1000|Scale=100|PaperSource=15|PrintQuality=600|MediaType=1|DitherType=10|PaperKind=Letter|PrintScaleMode=1; CurrentTime: Not shown in title block; CurrentDate: Not shown in title block; Time: Not shown in title block; DocumentFullPathAndName: Not shown in title block; DocumentName: Not shown in title block; ModifiedDate: Not shown in title block; ImagePath: Not shown in title block
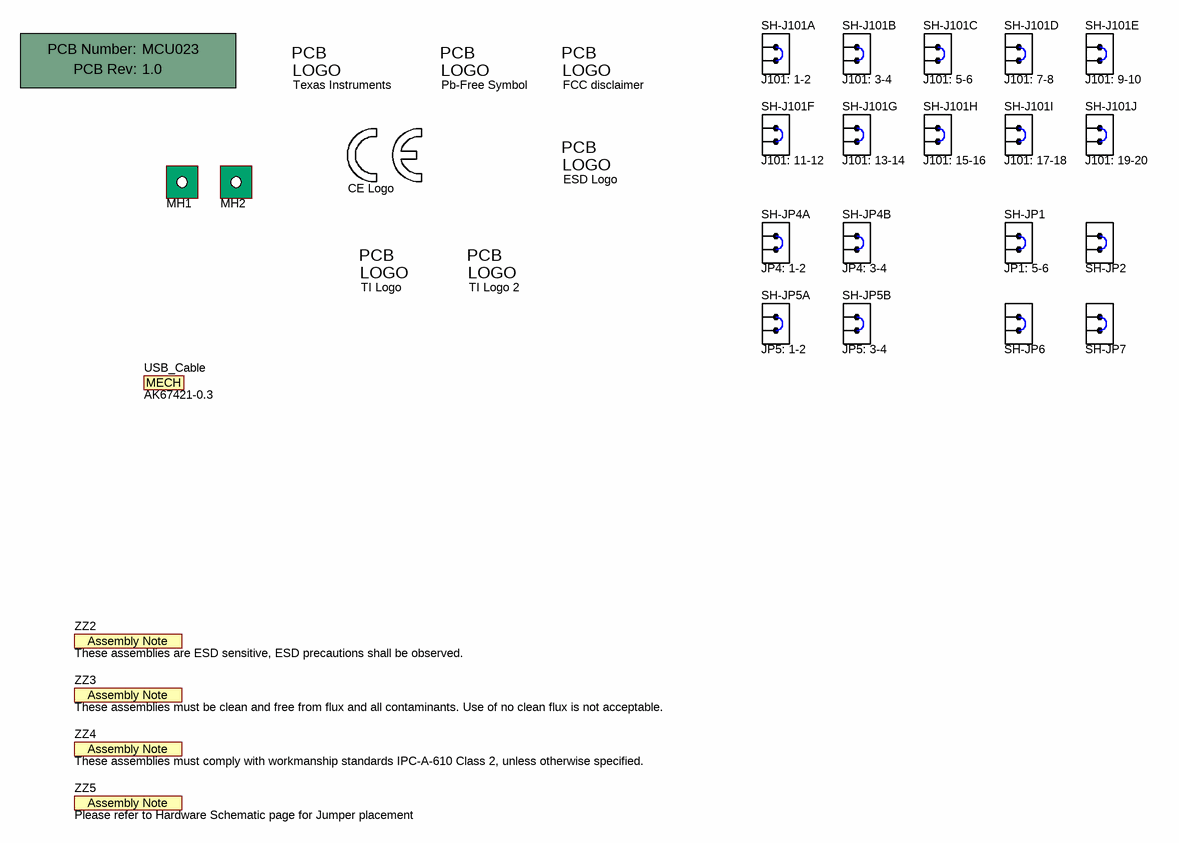
[diagram p5: MCU023_Hardware.SchDoc]

### Parts
!PCB  Printed Circuit Board  (value not drawn)  (mechanical)
CE_Logo  CE Mark  [CE_Mark_5mm]  (value not drawn)  (no BOM)
ESD_Logo  ESD Susceptible  [ESD_Overlay_Medium]  (value not drawn)  (no BOM)
Logo1  Texas Instruments  [TI_Stacked_Overlay_Small]  (no BOM)
Logo2  Pb-Free Symbol  [Pb-Free_Overlay_Medium]  (no BOM)
Logo3  FCC disclaimer  [FCC_disclaimer]  (no BOM)
MH1  MTG_NoPads  [NPTH125mil]  (value not drawn)  (no BOM)
MH2  MTG_NoPads  [NPTH125mil]  (value not drawn)  (no BOM)
SH-J101A  Note: J101: 1-2  [SNT-100-BK-G]  (hidden comment: SNT-100-BK-G)
SH-J101B  Note: J101: 3-4  [SNT-100-BK-G]  (hidden comment: SNT-100-BK-G)
SH-J101C  Note: J101: 5-6  [SNT-100-BK-G]  (hidden comment: SNT-100-BK-G)
SH-J101D  Note: J101: 7-8  [SNT-100-BK-G]  (hidden comment: SNT-100-BK-G)
SH-J101E  Note: J101: 9-10  [SNT-100-BK-G]  (hidden comment: SNT-100-BK-G)
SH-J101F  Note: J101: 11-12  [SNT-100-BK-G]  (hidden comment: SNT-100-BK-G)
SH-J101G  Note: J101: 13-14  [SNT-100-BK-G]  (hidden comment: SNT-100-BK-G)
SH-J101H  Note: J101: 15-16  [SNT-100-BK-G]  (hidden comment: SNT-100-BK-G)
SH-J101I  Note: J101: 17-18  [SNT-100-BK-G]  (hidden comment: SNT-100-BK-G)
SH-J101J  Note: J101: 19-20  [SNT-100-BK-G]  (hidden comment: SNT-100-BK-G)
SH-JP1  Note: JP1: 5-6  [SNT-100-BK-G]  (hidden comment: SNT-100-BK-G)
SH-JP2  SNT-100-BK-G  [SNT-100-BK-G]  (value not drawn)
SH-JP4A  Note: JP4: 1-2  [SNT-100-BK-G]  (hidden comment: SNT-100-BK-G)
SH-JP4B  Note: JP4: 3-4  [SNT-100-BK-G]  (hidden comment: SNT-100-BK-G)
SH-JP5A  Note: JP5: 1-2  [SNT-100-BK-G]  (hidden comment: SNT-100-BK-G)
SH-JP5B  Note: JP5: 3-4  [SNT-100-BK-G]  (hidden comment: SNT-100-BK-G)
SH-JP6  SNT-100-BK-G  [SNT-100-BK-G]  (value not drawn)
SH-JP7  SNT-100-BK-G  [SNT-100-BK-G]  (value not drawn)
TI_Logo  Texas Instruments  [TI_Symbol_Overlay_Medium]  (value not drawn)  (no BOM)
TI_Logo_2  Texas Instruments  [TI_Horizontal_Overlay_Small]  (value not drawn)  (no BOM)
USB_Cable  AK67421-0.3  (mechanical)
ZZ2  These assemblies are ESD sensitive, ESD precautions shall be observed.  [AssemblyNote]  (no BOM)
ZZ3  These assemblies must be clean and free from flux and all contaminants. Use of no clean flux is not acceptable.  [AssemblyNote]  (no BOM)
ZZ4  These assemblies must comply with workmanship standards IPC-A-610 Class 2, unless otherwise specified.  [AssemblyNote]  (no BOM)
ZZ5  Please refer to Hardware Schematic page for Jumper placement  [AssemblyNote]  (no BOM)

### Notes on the sheet
- Drawn By:
- SVN Rev:
- Number:
- TID #:
- Orderable:
- Rev:
- Sheet Title:
- File:
- Project Title:
- Designed for:
- Assembly Variant:
- Mod. Date:
- Sheet:
- Size:
- of
- B
- http://www.ti.com
- Texas Instruments and/or its licensors do not warrant the accuracy or completeness of this specification or any information contained therein. Texas Instruments and/or its licensors do not warrant that this design will meet the specifications, will be suitable for your application or fit for any particular purpose, or will operate in an implementation. Texas Instruments and/or its licensors do not warrant that the design is production worthy. You should completely validate and test your design implementation to confirm the system functionality for your application.
- Engineer:
- Contact:
- © Texas Instruments
- (in symbol AssemblyNote) Assembly Note
- (in symbol CMP-0077983-1) MECH
- (in symbol ESD_Susceptible) PCB; LOGO
- (in symbol FCC_disclaimer) PCB; LOGO
- (in symbol Pb-Free) PCB; LOGO
- (in symbol PCB) PCB Number:; PCB Rev:
- (in symbol TI_Logo) PCB; LOGO

### Library data of the parts
!PCB = PCB: Manufacturer: Any; PartNumber: MCU023; SymbolCreator: a0412235; SymbolVersion: 2012-05-30; CompType: PCB; RoHS: O; MountType: N/A; Publisher: Texas Instruments; LatestRevisionDate: 2012-06-27; LatestRevisionNote: Initial Version; Alternate Manufacturer: -; Alternate PartNumber: -
CE_Logo = CE Mark: SymbolCreator: a0412235; SymbolVersion: 2014-07-08; Published: 2009-03-03; Publisher: Texas Instruments; LatestRevisionDate: 2016-03-21
ESD_Logo = ESD_Susceptible: ESD Susceptible Symbol; SymbolCreator: a0412235; SymbolVersion: 2011-08-22; Published: 2009-03-03; Publisher: Texas Instruments; LatestRevisionDate: 2016-03-21
Logo1 = TI_Logo: Texas Instrument Corporate Signature; SymbolCreator: codlsc; SymbolVersion: 2011-08-22; Published: 2009-03-03; Publisher: National Semiconductor; ClassName: Logo; LatestRevisionDate: 2011-10-25; LatestRevisionNote: Added ClassName of Logo.
Logo2 = Pb-Free: SymbolCreator: a0412235; SymbolVersion: 2011-08-22; Published: 2009-03-03; Publisher: Texas Instruments; LatestRevisionDate: 2014-08-05
Logo3 = FCC_disclaimer: SymbolCreator: codlsc; SymbolVersion: 2011-08-22; Published: 2009-03-03; Publisher: Texas Instruments; LatestRevisionDate: 2014-11-20
MH1 MH2 = Mounting Hole (non-standard) No Pad: PCB Mounting Hole, No Pad; Manufacturer: Any; SymbolCreator: a0412235; SymbolVersion: 2013-12-26; CompType: Mounting Hole; PartNumber: N/A; PackageReference: Mounting Hole; MountType: N/A; Publisher: Texas Instruments; LatestRevisionDate: 2017-01-25
SH-J101A SH-J101B SH-J101C SH-J101D SH-J101E SH-J101F SH-J101G SH-J101H SH-J101I SH-J101J SH-JP1 SH-JP4A SH-JP4B SH-JP5A SH-JP5B = SNT-100-BK-G: Shunt, 100mil, Gold plated, Black; Manufacturer: Samtec; Alternate Manufacturer: 3M; Alternate PartNumber: 969102-0000-DA; Value: 1x2; Green_Lifecycle: Active; Green_REACh: Passed; ClassName: Shunt; CompType: Shunt; PartNumber: SNT-100-BK-G; RoHS: Y; PackageReference: Shunt; MountType: N/A; ComponentLink1Description: Datasheet Link; ComponentLink1URL: http://www.samtec.com/ftppub/pdf/SNT.PDF; Publisher: Texas Instruments; LatestRevisionDate: 2017-06-22; Supplier 1: Digi-Key; Supplier Part Number 1: SNT-100-BK-G-ND; Green_EU RoHS: Passed; Green_EU RoHS-2: Passed
SH-JP2 = SNT-100-BK-G: Shunt, 100mil, Gold plated, Black; Manufacturer: Samtec; Alternate Manufacturer: 3M; Alternate PartNumber: 969102-0000-DA; Value: 1x2; Note: JP2: 1-2; Green_Lifecycle: Active; Green_REACh: Passed; ClassName: Shunt; CompType: Shunt; PartNumber: SNT-100-BK-G; RoHS: Y; PackageReference: Shunt; MountType: N/A; ComponentLink1Description: Datasheet Link; ComponentLink1URL: http://www.samtec.com/ftppub/pdf/SNT.PDF; Publisher: Texas Instruments; LatestRevisionDate: 2017-06-22; Supplier 1: Digi-Key; Supplier Part Number 1: SNT-100-BK-G-ND; Green_EU RoHS: Passed; Green_EU RoHS-2: Passed
SH-JP6 = SNT-100-BK-G: Shunt, 100mil, Gold plated, Black; Manufacturer: Samtec; Alternate Manufacturer: 3M; Alternate PartNumber: 969102-0000-DA; Value: 1x2; Note: JP6: 1-2; Green_Lifecycle: Active; Green_REACh: Passed; ClassName: Shunt; CompType: Shunt; PartNumber: SNT-100-BK-G; RoHS: Y; PackageReference: Shunt; MountType: N/A; ComponentLink1Description: Datasheet Link; ComponentLink1URL: http://www.samtec.com/ftppub/pdf/SNT.PDF; Publisher: Texas Instruments; LatestRevisionDate: 2017-06-22; Supplier 1: Digi-Key; Supplier Part Number 1: SNT-100-BK-G-ND; Green_EU RoHS: Passed; Green_EU RoHS-2: Passed
SH-JP7 = SNT-100-BK-G: Shunt, 100mil, Gold plated, Black; Manufacturer: Samtec; Alternate Manufacturer: 3M; Alternate PartNumber: 969102-0000-DA; Value: 1x2; Note: JP7: 1-2; Green_Lifecycle: Active; Green_REACh: Passed; ClassName: Shunt; CompType: Shunt; PartNumber: SNT-100-BK-G; RoHS: Y; PackageReference: Shunt; MountType: N/A; ComponentLink1Description: Datasheet Link; ComponentLink1URL: http://www.samtec.com/ftppub/pdf/SNT.PDF; Publisher: Texas Instruments; LatestRevisionDate: 2017-06-22; Supplier 1: Digi-Key; Supplier Part Number 1: SNT-100-BK-G-ND; Green_EU RoHS: Passed; Green_EU RoHS-2: Passed
TI_Logo TI_Logo_2 = TI_Logo: Texas Instrument Corporate Signature; SymbolCreator: a0412235; SymbolVersion: 2011-08-22; ClassName: Logo; Published: 2009-03-03; Publisher: Texas Instruments; LatestRevisionDate: 2016-03-21
USB_Cable = CMP-0077983-1: Cable, USB-A to micro USB-B, 0.3 m; Manufacturer: Assman WSW; ComponentLink1URL: http://www.assmann-wsw.com/fileadmin/datasheets/ASS_7091_CA.pdf; Key: AK67421-0.3; CompType: Cable; Supplier 1: Digi-Key; RoHS: Y; Supplier Part Number 1: AE11229-ND; PartNumber: AK67421-0.3; MountType: N/A; ComponentLink1Description: Datasheet Link
ZZ2-ZZ4 = AssemblyNote: SymbolCreator: codlsc; SymbolVersion: 2010-05-18; CompType: AssemblyNote; ClassName: AssemblyNote; Publisher: Texas Instruments; LatestRevisionDate: 2012-06-14; LatestRevisionNote: Initial Version; Alternate Manufacturer: -; Alternate PartNumber: -
ZZ5 = AssemblyNote: These assemblies must comply with workmanship standards IPC-A-610 Class 2, unless otherwise specified.; SymbolCreator: codlsc; SymbolVersion: 2010-05-18; CompType: AssemblyNote; ClassName: AssemblyNote; Publisher: Texas Instruments; LatestRevisionDate: 2012-06-14; LatestRevisionNote: Initial Version; Alternate Manufacturer: -; Alternate PartNumber: -

## Nets that join several sheets
+3V3: MCU023_MSP432E_GPIO_USB (12 pins), MCU023_MSP432E_Ethernet_Power (J12.1 JP2.1), MCU023_XDS110_Target_Interface (J11.1 J101.5 U8.8)
+5V: MCU023_MSP432E_GPIO_USB (8 pins), MCU023_MSP432E_Ethernet_Power (J13.1 U4.7)
DEBUG_VBUS: MCU023_MSP432E_Ethernet_Power (JP1.5), MCU023_XDS110_Target_Interface (J101.3)
GND: MCU023_MSP432E_GPIO_USB (36 pins), MCU023_MSP432E_Ethernet_Power (43 pins), MCU023_XDS110_Target_Interface (6 pins)
MCU_3V3: MCU023_MSP432E_GPIO_USB (R1.2 R2.2), MCU023_MSP432E_Ethernet_Power (33 pins)
TARGET_VBUS: MCU023_MSP432E_GPIO_USB (5 pins), MCU023_MSP432E_Ethernet_Power (JP1.3 U4.6)
XDS_GND: MCU023_XDS110_USB_Power (10 pins), MCU023_XDS110_Target_Interface (6 pins), MCU023_XDS110_Debug_Probe (36 pins)
XDS_VCC: MCU023_XDS110_USB_Power (5 pins), MCU023_XDS110_Target_Interface (J101.6 J102.1 R158.2 U108.8), MCU023_XDS110_Debug_Probe (31 pins)
PD6: MCU023_MSP432E_GPIO_USB (J1/J3.28 J10.44 U1.127), MCU023_MSP432E_Ethernet_Power (JP7.2)
PF0: MCU023_MSP432E_GPIO_USB (J10.66 U1.42), MCU023_MSP432E_Ethernet_Power (D4.1)
PF4: MCU023_MSP432E_GPIO_USB (J10.64 U1.46), MCU023_MSP432E_Ethernet_Power (D3.1)
PQ4: MCU023_MSP432E_GPIO_USB (J10.93 U1.102), MCU023_MSP432E_Ethernet_Power (JP6.2)
RXD: MCU023_MSP432E_GPIO_USB (JP4.1), MCU023_XDS110_Target_Interface (J101.7)
TARGET_RESET: MCU023_MSP432E_GPIO_USB (BSL.4 J2/J4.16 J6/J8.16 J10.94), MCU023_MSP432E_Ethernet_Power (C46.2 R44.1 R51.2 U1.70), MCU023_XDS110_Target_Interface (J11.10 J101.11 U8.2)
TARGET_TXD: MCU023_MSP432E_GPIO_USB (JP5.1), MCU023_XDS110_Target_Interface (J101.9)
TCK_SWDCLK: MCU023_MSP432E_GPIO_USB (R1.1 U1.100), MCU023_XDS110_Target_Interface (J11.4 J101.15 U8.6)
TDI: MCU023_MSP432E_GPIO_USB (U1.98), MCU023_XDS110_Target_Interface (J11.8 J101.19 U8.3)
TDO_SWO: MCU023_MSP432E_GPIO_USB (U1.97), MCU023_XDS110_Target_Interface (J11.6 J101.17 U8.5)
TMS_SWDIO: MCU023_MSP432E_GPIO_USB (R2.1 U1.99), MCU023_XDS110_Target_Interface (J11.2 J101.13 U8.7)
VBUS_DETECT: MCU023_XDS110_USB_Power (R122.1 R124.2), MCU023_XDS110_Debug_Probe (IC106.1)
VREF+: MCU023_MSP432E_GPIO_USB (J10.34), MCU023_MSP432E_Ethernet_Power (R41.2 TP13.1 U1.9)
Wake: MCU023_MSP432E_GPIO_USB (J10.95), MCU023_MSP432E_Ethernet_Power (R42.1 TP10.1 U1.64 Wake_SW4.3)
XDS_DM: MCU023_XDS110_USB_Power (IC102.5 USB101.2), MCU023_XDS110_Debug_Probe (IC106.93)
XDS_DP: MCU023_XDS110_USB_Power (IC102.4 USB101.3), MCU023_XDS110_Debug_Probe (IC106.94)
XDS_ID: MCU023_XDS110_USB_Power (IC102.2 USB101.4), MCU023_XDS110_Debug_Probe (IC106.95)
XDS_RESET_OUT: MCU023_XDS110_Target_Interface (J101.12 J102.10 R158.1 U108.2), MCU023_XDS110_Debug_Probe (IC106.40)
XDS_RXD: MCU023_XDS110_Target_Interface (J101.10), MCU023_XDS110_Debug_Probe (IC106.33)
XDS_TCK_SWDCLK: MCU023_XDS110_Target_Interface (J101.16 J102.4 U108.6), MCU023_XDS110_Debug_Probe (IC106.35)
XDS_TDI: MCU023_XDS110_Target_Interface (J101.20 J102.8 U108.3), MCU023_XDS110_Debug_Probe (IC106.38)
XDS_TDO_SWO: MCU023_XDS110_Target_Interface (J101.18 J102.6 U108.5), MCU023_XDS110_Debug_Probe (IC106.37)
XDS_TMS_SWDIO: MCU023_XDS110_Target_Interface (J101.14 J102.2 U108.7), MCU023_XDS110_Debug_Probe (IC106.36)
XDS_TXD: MCU023_XDS110_Target_Interface (J101.8), MCU023_XDS110_Debug_Probe (IC106.34)
XDS_VBUS: MCU023_XDS110_USB_Power (7 pins), MCU023_XDS110_Target_Interface (J101.4), MCU023_XDS110_Debug_Probe (R166.1)

## Assembly variants
001: not fitted BSL J10 R3 R5 R6 R7 R8 R9 R10 R11 R12 R13 R14 R19 R20 R121 TP4 TP5 TP6 TP7 TP8 TP9 TP10 TP11 TP12 TP13 TP14 TP15 TP16 TP17